# Altium schematic sheet IOs.SchDoc
size A4; SheetNumber: 3; SheetTotal: 9
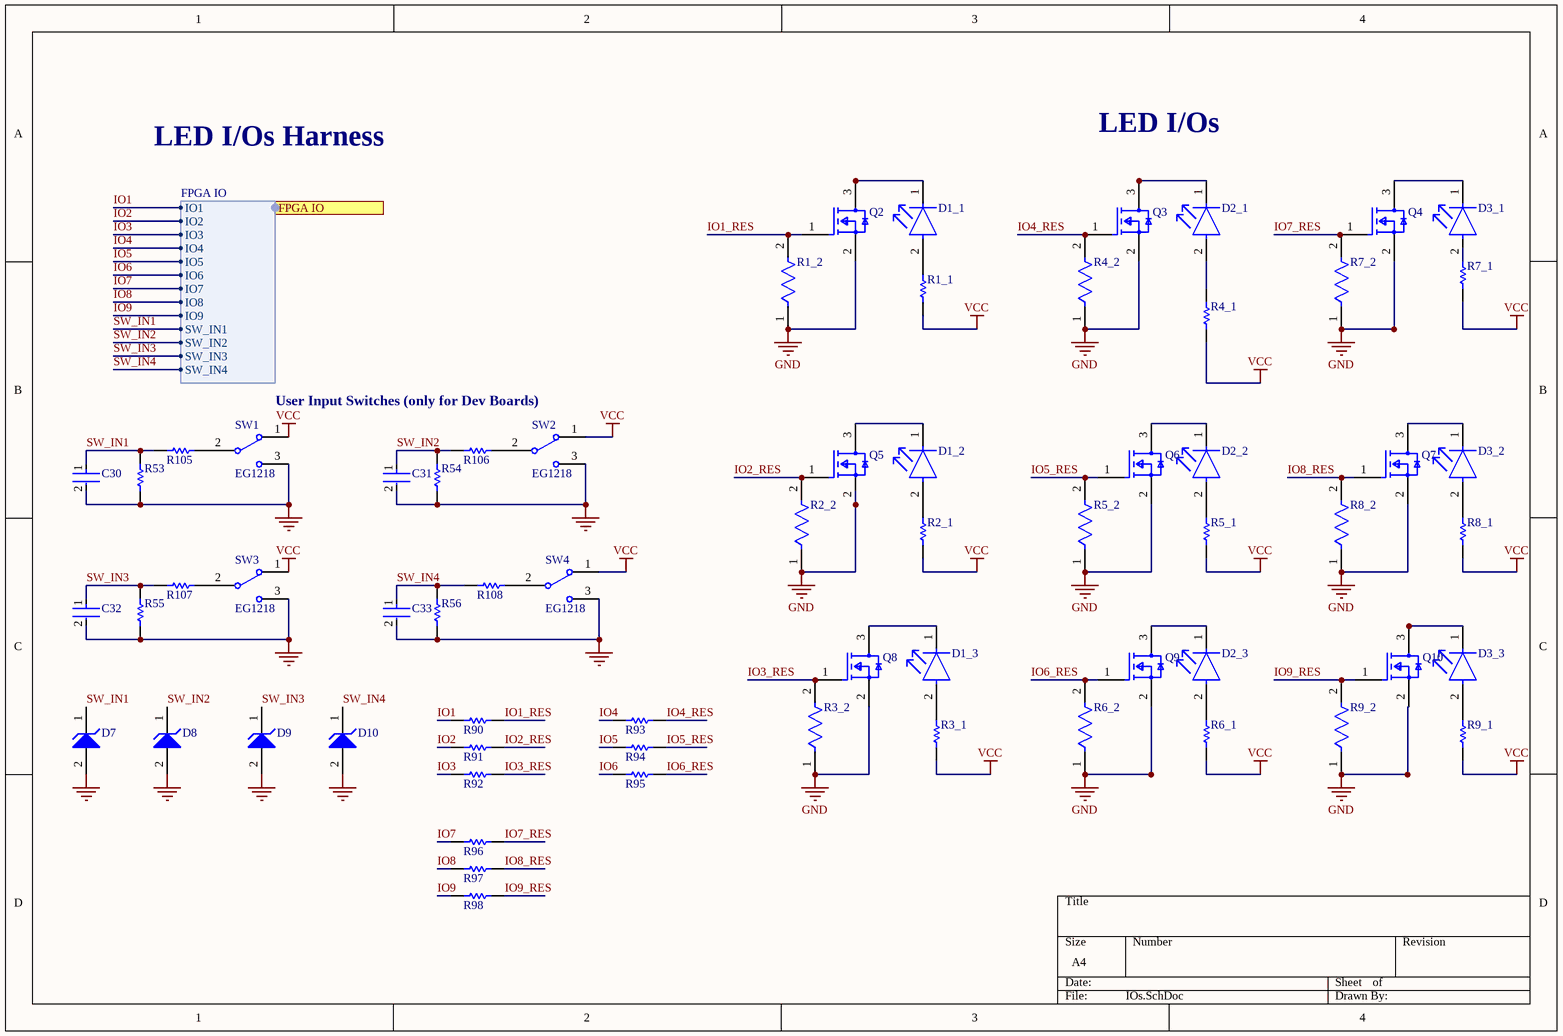
[diagram p0: IOs.SchDoc]

## Parts
C30  CC0402KRX7R9BB103  [FP-CC0402-MFG]  (value not drawn)
C31  CC0402KRX7R9BB103  [FP-CC0402-MFG]  (value not drawn)
C32  CC0402KRX7R9BB103  [FP-CC0402-MFG]  (value not drawn)
C33  CC0402KRX7R9BB103  [FP-CC0402-MFG]  (value not drawn)
D1_1  LTST-C230KRKT  [FP-LTST-C230KRKT-MFG]  (value not drawn)
D1_2  LTST-C230KRKT  [FP-LTST-C230KRKT-MFG]  (value not drawn)
D1_3  LTST-C230KRKT  [FP-LTST-C230KRKT-MFG]  (value not drawn)
D2_1  LTST-C230KRKT  [FP-LTST-C230KRKT-MFG]  (value not drawn)
D2_2  LTST-C230KRKT  [FP-LTST-C230KRKT-MFG]  (value not drawn)
D2_3  LTST-C230KRKT  [FP-LTST-C230KRKT-MFG]  (value not drawn)
D3_1  LTST-C230KRKT  [FP-LTST-C230KRKT-MFG]  (value not drawn)
D3_2  LTST-C230KRKT  [FP-LTST-C230KRKT-MFG]  (value not drawn)
D3_3  LTST-C230KRKT  [FP-LTST-C230KRKT-MFG]  (value not drawn)
D7  MM5Z3V3T1G  [ONSC-SOD-523-2-502-01_V]  (value not drawn)
D8  MM5Z3V3T1G  [ONSC-SOD-523-2-502-01_V]  (value not drawn)
D9  MM5Z3V3T1G  [ONSC-SOD-523-2-502-01_V]  (value not drawn)
D10  MM5Z3V3T1G  [ONSC-SOD-523-2-502-01_V]  (value not drawn)
Q2  MMBF170LT1G  [FP-318-08-IPC_B]  (value not drawn)
Q3  MMBF170LT1G  [FP-318-08-IPC_B]  (value not drawn)
Q4  MMBF170LT1G  [FP-318-08-IPC_B]  (value not drawn)
Q5  MMBF170LT1G  [FP-318-08-IPC_B]  (value not drawn)
Q6  MMBF170LT1G  [FP-318-08-IPC_B]  (value not drawn)
Q7  MMBF170LT1G  [FP-318-08-IPC_B]  (value not drawn)
Q8  MMBF170LT1G  [FP-318-08-IPC_B]  (value not drawn)
Q9  MMBF170LT1G  [FP-318-08-IPC_B]  (value not drawn)
Q10  MMBF170LT1G  [FP-318-08-IPC_B]  (value not drawn)
R1_1  RC0402FR-07330RL  [RESC1005X40X25LL05T10]  (value not drawn)
R1_2  RC0402JR-0710KL  [FP-RC0402-0_4-IPC_C]  (value not drawn)
R2_1  RC0402FR-07330RL  [RESC1005X40X25LL05T10]  (value not drawn)
R2_2  RC0402JR-0710KL  [FP-RC0402-0_4-IPC_C]  (value not drawn)
R3_1  RC0402FR-07330RL  [RESC1005X40X25LL05T10]  (value not drawn)
R3_2  RC0402JR-0710KL  [FP-RC0402-0_4-IPC_C]  (value not drawn)
R4_1  RC0402FR-07330RL  [RESC1005X40X25LL05T10]  (value not drawn)
R4_2  RC0402JR-0710KL  [FP-RC0402-0_4-IPC_C]  (value not drawn)
R5_1  RC0402FR-07330RL  [RESC1005X40X25LL05T10]  (value not drawn)
R5_2  RC0402JR-0710KL  [FP-RC0402-0_4-IPC_C]  (value not drawn)
R6_1  RC0402FR-07330RL  [RESC1005X40X25LL05T10]  (value not drawn)
R6_2  RC0402JR-0710KL  [FP-RC0402-0_4-IPC_C]  (value not drawn)
R7_1  RC0402FR-07330RL  [RESC1005X40X25LL05T10]  (value not drawn)
R7_2  RC0402JR-0710KL  [FP-RC0402-0_4-IPC_C]  (value not drawn)
R8_1  RC0402FR-07330RL  [RESC1005X40X25LL05T10]  (value not drawn)
R8_2  RC0402JR-0710KL  [FP-RC0402-0_4-IPC_C]  (value not drawn)
R9_1  RC0402FR-07330RL  [RESC1005X40X25LL05T10]  (value not drawn)
R9_2  RC0402JR-0710KL  [FP-RC0402-0_4-IPC_C]  (value not drawn)
R53  3K3 5% 0603(1608)  [RESC0603(1608)_N]  (value not drawn)
R54  3K3 5% 0603(1608)  [RESC0603(1608)_N]  (value not drawn)
R55  3K3 5% 0603(1608)  [RESC0603(1608)_N]  (value not drawn)
R56  3K3 5% 0603(1608)  [RESC0603(1608)_N]  (value not drawn)
R90  RC0402FR-07330RL  [RESC1005X40X25LL05T10]  (value not drawn)
R91  RC0402FR-07330RL  [RESC1005X40X25LL05T10]  (value not drawn)
R92  RC0402FR-07330RL  [RESC1005X40X25LL05T10]  (value not drawn)
R93  RC0402FR-07330RL  [RESC1005X40X25LL05T10]  (value not drawn)
R94  RC0402FR-07330RL  [RESC1005X40X25LL05T10]  (value not drawn)
R95  RC0402FR-07330RL  [RESC1005X40X25LL05T10]  (value not drawn)
R96  RC0402FR-07330RL  [RESC1005X40X25LL05T10]  (value not drawn)
R97  RC0402FR-07330RL  [RESC1005X40X25LL05T10]  (value not drawn)
R98  RC0402FR-07330RL  [RESC1005X40X25LL05T10]  (value not drawn)
R105  RC0402FR-07330RL  [RESC1005X40X25LL05T10]  (value not drawn)
R106  RC0402FR-07330RL  [RESC1005X40X25LL05T10]  (value not drawn)
R107  RC0402FR-07330RL  [RESC1005X40X25LL05T10]  (value not drawn)
R108  RC0402FR-07330RL  [RESC1005X40X25LL05T10]  (value not drawn)
SW1  EG1218  [ESWI-EG1218_V]
SW2  EG1218  [ESWI-EG1218_V]
SW3  EG1218  [ESWI-EG1218_V]
SW4  EG1218  [ESWI-EG1218_V]

## Ports
FPGA IO (harness FPGA IO, see root[4B], FPGA2[3A])

## Harnesses
FPGA IO: IO1, IO2, IO3, IO4, IO5, IO6, IO7, IO8, IO9, SW_IN1, SW_IN2, SW_IN3, SW_IN4

## Nets
GND: C30.2 C31.2 C32.2 C33.2 D7.2(A) D8.2(A) D9.2(A) D10.2(A) Q2.2(S) Q3.2(S) Q4.2(S) Q5.2(S) Q6.2(S) Q7.2(S) Q8.2(S) Q9.2(S) Q10.2(S) R1_2.1 R2_2.1 R3_2.1 R4_2.1 R5_2.1 R6_2.1 R7_2.1 R8_2.1 R9_2.1 R53.1 R54.1 R55.1 R56.1 SW1.3 SW2.3 SW3.3 SW4.3
VCC: R1_1.1 R2_1.1 R3_1.1 R4_1.1 R5_1.1 R6_1.1 R7_1.1 R8_1.1 R9_1.1 SW1.1 SW2.1 SW3.1 SW4.1
IO1: R90.2 ; port FPGA IO.IO1
IO1_RES: Q2.1(G) R1_2.2 R90.1
IO2: R91.2 ; port FPGA IO.IO2
IO2_RES: Q5.1(G) R2_2.2 R91.1
IO3: R92.2 ; port FPGA IO.IO3
IO3_RES: Q8.1(G) R3_2.2 R92.1
IO4: R93.2 ; port FPGA IO.IO4
IO4_RES: Q3.1(G) R4_2.2 R93.1
IO5: R94.2 ; port FPGA IO.IO5
IO5_RES: Q6.1(G) R5_2.2 R94.1
IO6: R95.2 ; port FPGA IO.IO6
IO6_RES: Q9.1(G) R6_2.2 R95.1
IO7: R96.2 ; port FPGA IO.IO7
IO7_RES: Q4.1(G) R7_2.2 R96.1
IO8: R97.2 ; port FPGA IO.IO8
IO8_RES: Q7.1(G) R8_2.2 R97.1
IO9: R98.2 ; port FPGA IO.IO9
IO9_RES: Q10.1(G) R9_2.2 R98.1
SW_IN1: C30.1 D7.1(K) R53.2 R105.2 ; port FPGA IO.SW_IN1
SW_IN2: C31.1 D8.1(K) R54.2 R106.2 ; port FPGA IO.SW_IN2
SW_IN3: C32.1 D9.1(K) R55.2 R107.2 ; port FPGA IO.SW_IN3
SW_IN4: C33.1 D10.1(K) R56.2 R108.2 ; port FPGA IO.SW_IN4
NetD1_1_1: D1_1.1(C) Q2.3(D)
NetD1_1_2: D1_1.2(A) R1_1.2
NetD1_2_1: D1_2.1(C) Q5.3(D)
NetD1_2_2: D1_2.2(A) R2_1.2
NetD1_3_1: D1_3.1(C) Q8.3(D)
NetD1_3_2: D1_3.2(A) R3_1.2
NetD2_1_1: D2_1.1(C) Q3.3(D)
NetD2_1_2: D2_1.2(A) R4_1.2
NetD2_2_1: D2_2.1(C) Q6.3(D)
NetD2_2_2: D2_2.2(A) R5_1.2
NetD2_3_1: D2_3.1(C) Q9.3(D)
NetD2_3_2: D2_3.2(A) R6_1.2
NetD3_1_1: D3_1.1(C) Q4.3(D)
NetD3_1_2: D3_1.2(A) R7_1.2
NetD3_2_1: D3_2.1(C) Q7.3(D)
NetD3_2_2: D3_2.2(A) R8_1.2
NetD3_3_1: D3_3.1(C) Q10.3(D)
NetD3_3_2: D3_3.2(A) R9_1.2
NetR105_1: R105.1 SW1.2(COM)
NetR106_1: R106.1 SW2.2(COM)
NetR107_1: R107.1 SW3.2(COM)
NetR108_1: R108.1 SW4.2(COM)

## Notes on the sheet
- LED I/Os Harness
- LED I/Os
- User Input Switches (only for Dev Boards)

## Library data of the parts
C30-C33 = CMP-2100-03592-2: CAP CER 10000PF 50V X7R 0402; Manufacturer: YAGEO; Temperature Coefficient: 30ppm/°C; Capacitance: 10 nF; Material: Ceramic; Automotive Grade: NA; Tolerance: 0.1; Value: 10 nF; Device Class L3: Ceramic Capacitors; Temperature: -55°C to +125°C; Footprint Url: http://www.yageo.com/exep/pages/download/literatures/UPY-C_GEN_24.pdf; Ipc Land Pattern Name: CAPC10050X50; Device Class L1: Passive Components; Automotive: No; Octopart: https://octopart.com/cc0402krx7r9bb103-yageo-8376513; Manufacturer Part Number: CC0402KRX7R9BB103; Lead Free: Yes; Temperature Range Low: -55°C; Height: 0.55mm; ComponentLink2URL: http://www.yageo.com/documents/recent/UPY-GP_NP0_16V-to-50V_16.pdf; Category: Cap; ComponentLink2Description: Datasheet; Temperature Range High: +125°C; Digikey Description: CAP CER 10000PF 50V X7R 0402; Voltage Rating: 50 V; Package: CC0402; Device Class L2: Capacitors; Mouser Description: 0402 10 nF 50 V ±10 % Tolerance X7R SMT Multilayer Ceramic Capacitor; RoHS: TRUE; Temperature Characteristic: X7R
D1_1-D1_3 D2_1-D2_3 D3_1-D3_3 = CMP-22017-000041-1: LED RED CLEAR CHIP SMD; Dominant Wavelength: 631nm; Lens Color: Colorless; Lens Style: Diffused; Forward Voltage: 2V; Test Current: 20mA; Luminous Intensity: 54mcd; Number of LEDs: 1; Viewing Angle: 130°; Power Rating: 75mW; Forward Current: 30mA; Wavelength: 639nm; Reverse Voltage: 5V; Min Operating Temperature: -55°C; Height: 1.1mm; Length: 3.2mm; Lens Transparency: Clear; Case/Package: 1206; Package Quantity: 1; Width: 1.6mm; Max Operating Temperature: 85°C; Packaging: Tape and Reel; RoHS Compliant: Yes; Mount: Surface Mount; Lead Free: Lead Free; Depth: 1.6mm; Power Dissipation: 75mW; Number of Pins: 2; Number of Elements: 1; Color: Red; Illumination Color: Red; Case Code (Imperial): 1206; Case Code (Metric): 3216; Radiation Hardening: No
D7-D10 = CMP-1060-00750-1: Zener Voltage Regulator, 500 mW, 2-Pin SOD-523, Pb-Free, Tape and Reel; Manufacturer: On Semiconductor; P Max (W): 0.5; VZ Typ (V): 3.3; RoHS: Pb-Free; ComponentLink2Description: Datasheet; PackageReference: SOD-523-2-502-01; DatasheetVersion: Rev. 10; ComponentLink1Description: Manufacturer URL; PackageVersion: Rev. E, 09/2010; ComponentLink3URL: http://www.onsemi.com/pub_link/Collateral/502-01.PDF; ComponentLink2URL: http://www.onsemi.cn/pub_link/Collateral/MM5Z2V4T1-D.PDF; Mounting Technology: Surface Mount; PartNumber: MM5Z3V3T1G; Packing: Tape and Reel; PackageDescription: 2-Pin SOD, Body 1.2 x 0.8 mm; ComponentLink1URL: http://www.onsemi.com/; ComponentLink3Description: Package Specification
Q2-Q10 = CMP-1058-00793-2: MOSFET N-CH 60V 500MA SOT-23; Polarization: N; Rds On Max: 5R; Power Dissipation: 225mW; Number of Elements: 1; Element Configuration: Single; Input Capacitance: 60pF; Threshold Voltage: 3V; Polarity: N-CHANNEL; Gate to Source Voltage (Vgs): 20V; Turn-Off Delay Time: 10ns; Drain to Source Breakdown Voltage: 60V; On-State Resistance: 5R; Width: 1.3mm; Voltage Rating (DC): 60V; Package Quantity: 3000; Max Operating Temperature: 150°C; Drain to Source Resistance: 5R; Drain-source On Resistance-Max: 5R; Packaging: Tape and Reel; REACH SVHC: No SVHC; Case/Package: SOT-23-3; Number of Pins: 3; RoHS Compliant: Yes; Radiation Hardening: No; Min Operating Temperature: -55°C; Continuous Drain Current (ID): 500mA; Lead Free: Lead Free; Height: 0.94mm; Current Rating: 500mA; Turn-On Delay Time: 10ns; Series: -; Max Power Dissipation: 225mW; Length: 2.9mm; Nominal Vgs: 3V
R1_1 R2_1 R3_1 R4_1 R5_1 R6_1 R7_1 R8_1 R9_1 R90-R98 R105-R108 = CMP-2002-07613-1: Manufacturer: Yageo / Phycomp; Part Number: RC0402FR-07330RL
R1_2 R2_2 R3_2 R4_2 R5_2 R6_2 R7_2 R8_2 R9_2 = CMP-2002-07915-3: RES 10K OHM 5% 1/16W 0402; Max Power Dissipation: 63mW; Temperature Coefficient: 100ppm/°C; Power Rating: 62.5mW; Resistance: 10kR; Voltage Rating: 50V; Size Code: 0402; Resistance Tolerance: 5%; Packaging: Tape and Reel; Case Code (Metric): 1005; Lead Free: Lead Free; Resistor Type: Thick Film; Min Operating Temperature: -55°C; Military Standard: Not; Depth: 0.5mm; Series: RC; Case/Package: 0402; Construction: Rectangular; Number of Terminations: 2; Package Quantity: 1; Termination: SMD/SMT; Length: 0.039inch; Case Code (Imperial): 0402; Height: 0.016inch; Features: Moisture Resistant; RoHS Compliant: Yes; Max Operating Temperature: 155°C; Tolerance: 5%; Width: 0.02inch
R53-R56 = CMP-1012-00086-1: 3K3 0.1W 5% 0603 (1608 Metric)  SMD; Case-EIA: 0603; Value: 3300.00 Ohm; Case-Metric: 1608; Technology: SMT; Tolerance: 5 %; Power: 0.1 W
SW1-SW4 = CMP-1696-00002-1: Slide Switch, 500 V, -20 to 70 degC, 3-Pin THD, RoHS; Case\Package: SOT-23-5; Output Current: 150 mA; Nominal Output Voltage: 3.3 V; Max Power Dissipation: 250 mW; Min Input Voltage: 4.3 V; Outputs: 1; Max Input Voltage: 8 V; Dropout Voltage: 300 mV; PackageDescription: 3-Pin Through Hole Device, Body 11.6 x 4 mm, Pitch 2.5 mm; ComponentLink1URL: http://www.e-switch.ch/en/; RoHSCompliant: true; Length: 3 mm; ComponentLink1Description: Manufacturer URL; Power Rating: 250 mW; Mount: Surface Mount; Max Operating Temperature: 85 degC; REACH SVHC: No SVHC; Radiation Hardening: No; Height: 1.3 mm; Pins: 5; Max Ouput Current: 150 mA; Output Voltage: 3.3 V; Width: 1.8 mm; Package Quantity: 3000; ComponentLink2URL: https://www.e-switch.com/system/asset/product_line/data_sheet/119/EG.pdf; Min Operating Temperature: -40 degC; ComponentLink2Description: Datasheet; DatasheetVersion: Oct-15; PackageReference: EG1218; Packaging: Tape and Reel